# Altium schematic sheet nav teensy.SchDoc
size A3; SheetNumber: 1; SheetTotal: 1
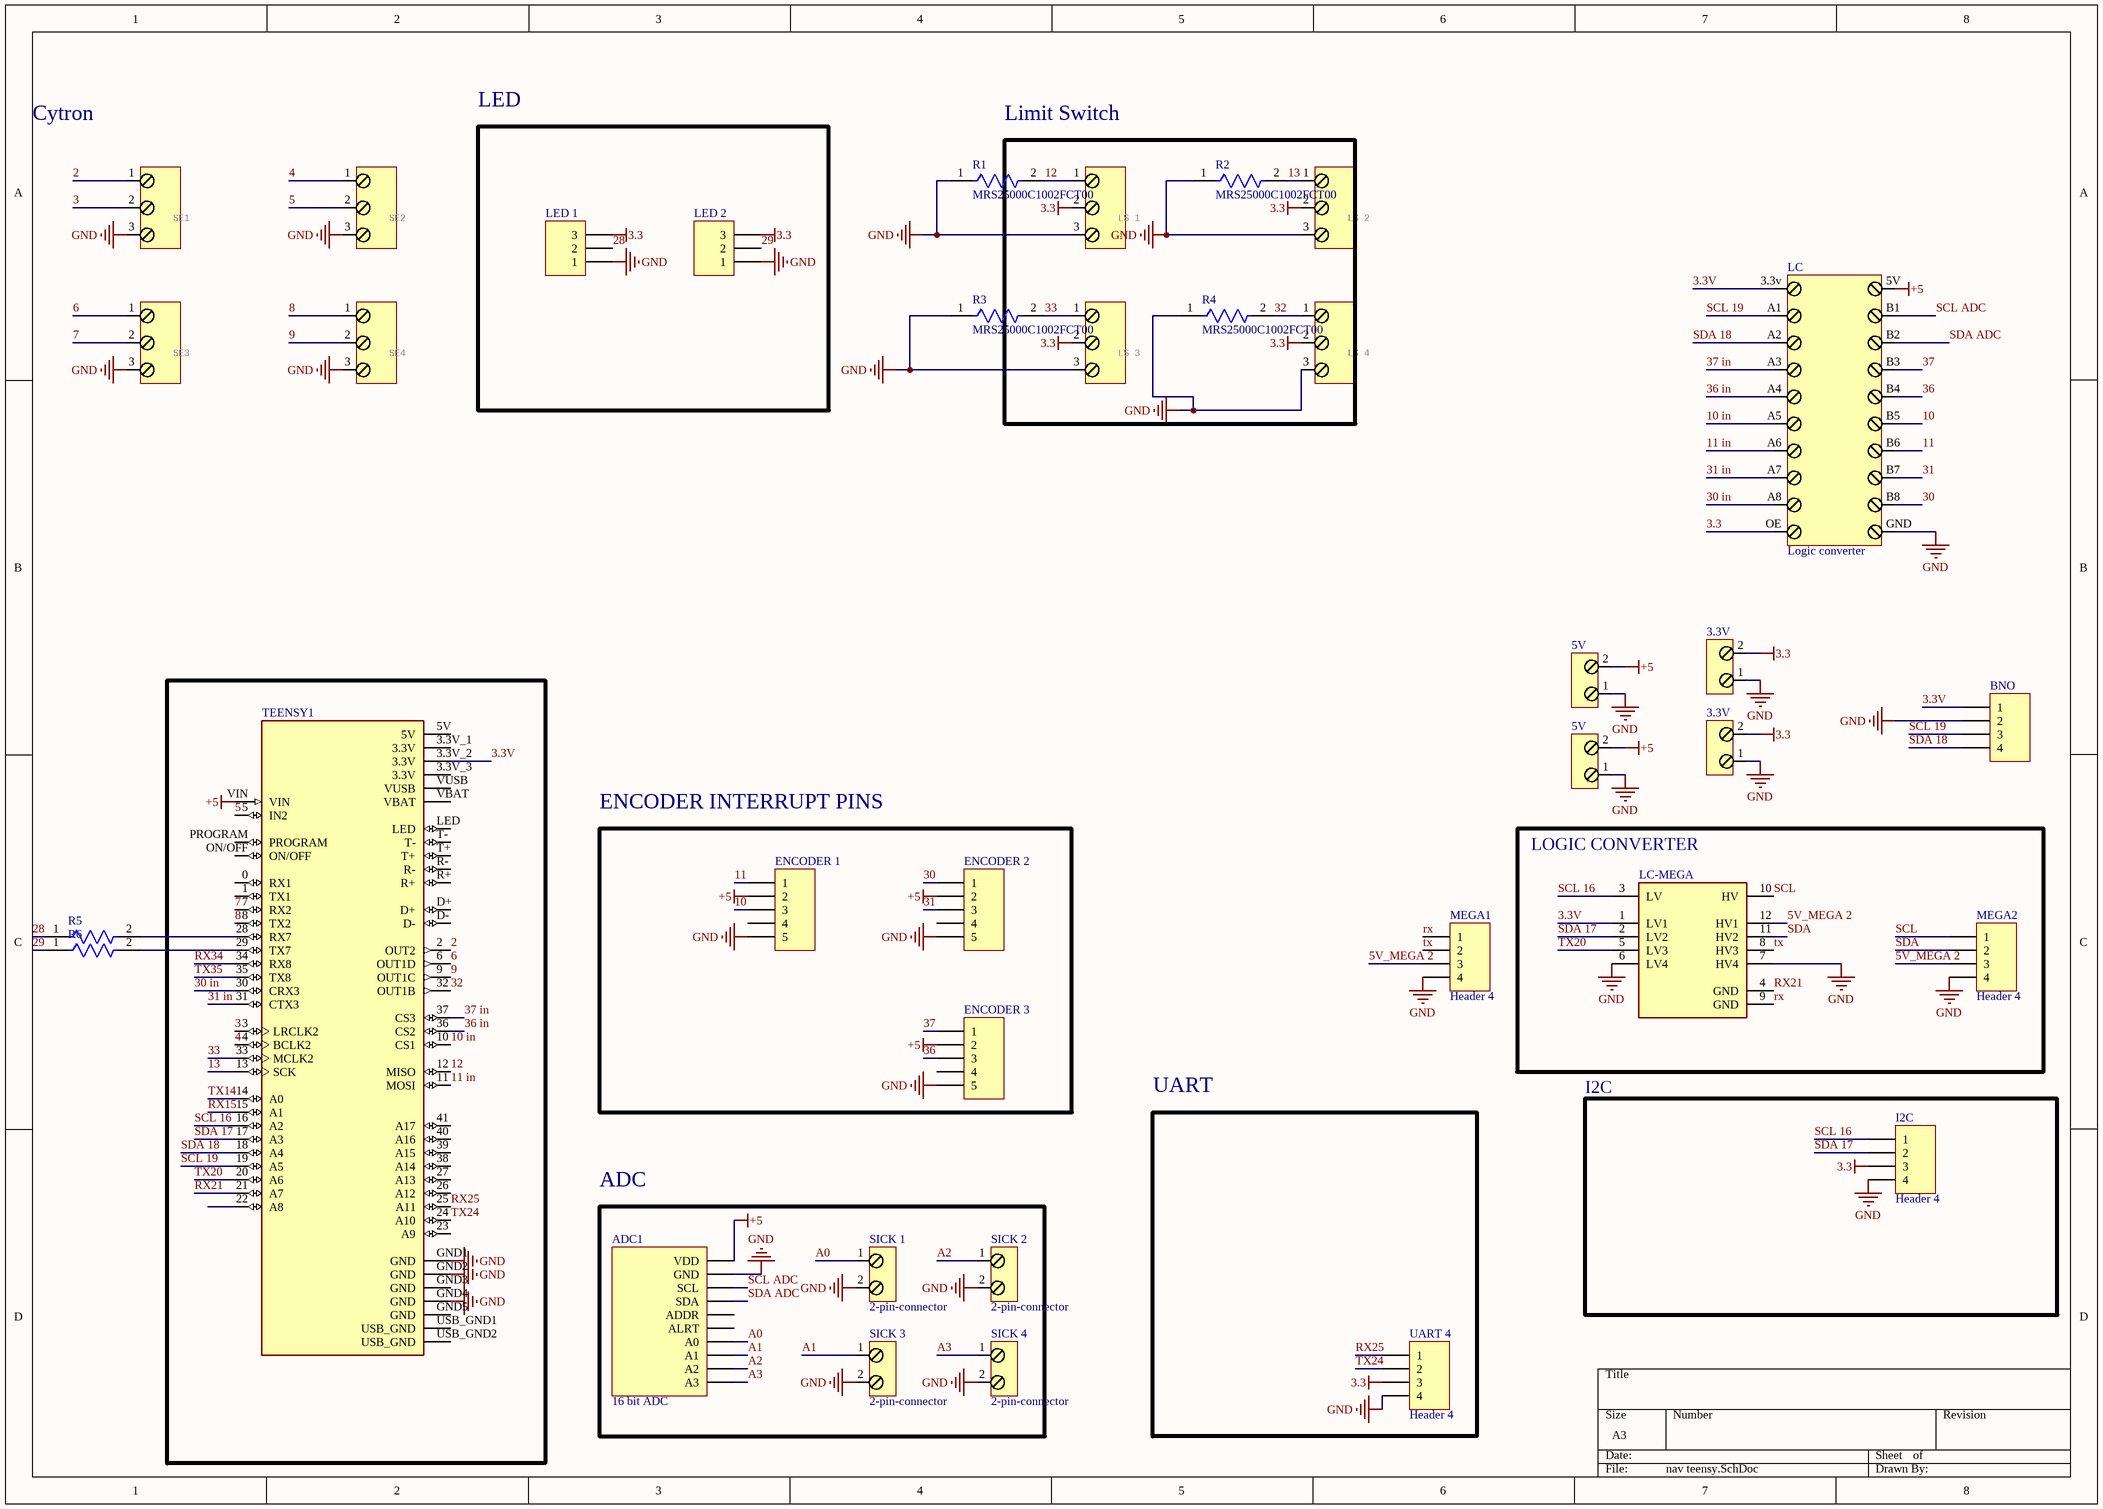
[diagram p0: nav teensy.SchDoc]

## Parts
(Parts that share a designator on the sheet are numbered #1, #2 ... from top to bottom, then left to right.)
3.3V#1  2-pin-connector  [HDR1X2]  (value not drawn)
3.3V#2  2-pin-connector  [HDR1X2]  (value not drawn)
5V#1  2-pin-connector  [HDR1X2]  (value not drawn)
5V#2  2-pin-connector  [HDR1X2]  (value not drawn)
ADC1  16 bit ADC  [16 bit ADC]
BNO  Header 4  [HDR1X4]  (value not drawn)
ENCODER_1  Header 5  [HDR1X5]  (value not drawn)
ENCODER_2  Header 5  [HDR1X5]  (value not drawn)
ENCODER_3  Header 5  [HDR1X5]  (value not drawn)
I2C  Header 4  [HDR1X4]
LC  Logic converter  [LOGIC_CONVERTER_5V-3-3V]
LC-MEGA  BOB-12009  [FP-BOB-12009-MFG]  (value not drawn)
LED_1  Header 3  [HDR1X3]  (value not drawn)
LED_2  Header 3  [HDR1X3]  (value not drawn)
LS_1  PHOENIX CONNECTOR  [HDR1X3]  (value not drawn)
LS_2  PHOENIX CONNECTOR  [HDR1X3]  (value not drawn)
LS_3  PHOENIX CONNECTOR  [HDR1X3]  (value not drawn)
LS_4  PHOENIX CONNECTOR  [HDR1X3]  (value not drawn)
MEGA1  Header 4  [HDR1X4]
MEGA2  Header 4  [HDR1X4]
R1  MRS25000C1002FCT00  [FP-MRS25-MFG]
R2  MRS25000C1002FCT00  [FP-MRS25-MFG]
R3  MRS25000C1002FCT00  [FP-MRS25-MFG]
R4  MRS25000C1002FCT00  [FP-MRS25-MFG]
R5  MRS25000C1002FCT00  [FP-MRS25-MFG]  (value not drawn)
R6  MRS25000C1002FCT00  [FP-MRS25-MFG]  (value not drawn)
SE1  PHOENIX CONNECTOR  [HDR1X3]  (value not drawn)
SE2  PHOENIX CONNECTOR  [HDR1X3]  (value not drawn)
SE3  PHOENIX CONNECTOR  [HDR1X3]  (value not drawn)
SE4  PHOENIX CONNECTOR  [HDR1X3]  (value not drawn)
SICK_1  2-pin-connector  [HDR1X2]
SICK_2  2-pin-connector  [HDR1X2]
SICK_3  2-pin-connector  [HDR1X2]
SICK_4  2-pin-connector  [HDR1X2]
TEENSY1  DEV-16771  [MODULE_DEV-16771]  (value not drawn)
UART_4  Header 4  [HDR1X4]

## Blocks framed on the sheet
LED: LED_1 LED_2
Limit Switch: LS_1-LS_4 R2 R4
ENCODER INTERRUPT PINS: ENCODER_1-ENCODER_3
LOGIC CONVERTER: LC-MEGA MEGA2
I2C: I2C
UART: UART_4
ADC: ADC1 SICK_1-SICK_4

## Nets
3.3: 3.3V#1.2 3.3V#2.2 I2C.3 LC.OE LED_1.3 LED_2.3 LS_1.2 LS_2.2 LS_3.2 LS_4.2 UART_4.3
+5: 5V#1.2 5V#2.2 ADC1.VDD ENCODER_1.2 ENCODER_2.2 ENCODER_3.2 LC.5V TEENSY1.VIN
GND: 3.3V#1.1 3.3V#2.1 5V#1.1 5V#2.1 ADC1.GND BNO.2 ENCODER_1.5 ENCODER_2.5 ENCODER_3.5 I2C.4 LC.GND LC-MEGA.6(LV4) LC-MEGA.7(HV4) LED_1.1 LED_2.1 LS_1.3 LS_2.3 LS_3.3 LS_4.3 MEGA1.4 MEGA2.4 R1.1 R2.1 R3.1 R4.1 SE1.3 SE2.3 SE3.3 SE4.3 SICK_1.2 SICK_2.2 SICK_3.2 SICK_4.2 TEENSY1.GND1(GND) TEENSY1.GND2(GND) TEENSY1.GND4(GND) UART_4.4
2: SE1.1 TEENSY1.2(OUT2)
3: SE1.2 TEENSY1.3(LRCLK2)
3.3V: BNO.1 LC.3.3v LC-MEGA.1(LV1) TEENSY1.3.3V_2(3.3V)
4: SE2.1 TEENSY1.4(BCLK2)
5: SE2.2 TEENSY1.5(IN2)
5V_MEGA 2: LC-MEGA.12(HV1) MEGA1.3 MEGA2.3
6: SE3.1 TEENSY1.6(OUT1D)
7: SE3.2 TEENSY1.7(RX2)
8: SE4.1 TEENSY1.8(TX2)
9: SE4.2 TEENSY1.9(OUT1C)
10: ENCODER_1.3 LC.B5
10 in: LC.A5 TEENSY1.10(CS1)
11: ENCODER_1.1 LC.B6
11 in: LC.A6 TEENSY1.11(MOSI)
12: LS_1.1 R1.2 TEENSY1.12(MISO)
13: LS_2.1 R2.2 TEENSY1.13(SCK)
28: LED_1.2 R5.1
29: LED_2.2 R6.1
30: ENCODER_2.1 LC.B8
30 in: LC.A8 TEENSY1.30(CRX3)
31: ENCODER_2.3 LC.B7
31 in: LC.A7 TEENSY1.31(CTX3)
32: LS_4.1 R4.2 TEENSY1.32(OUT1B)
33: LS_3.1 R3.2 TEENSY1.33(MCLK2)
36: ENCODER_3.3 LC.B4
36 in: LC.A4 TEENSY1.36(CS2)
37: ENCODER_3.1 LC.B3
37 in: LC.A3 TEENSY1.37(CS3)
A0: ADC1.A0 SICK_1.1
A1: ADC1.A1 SICK_3.1
A2: ADC1.A2 SICK_2.1
A3: ADC1.A3 SICK_4.1
rx: LC-MEGA.9(GND) MEGA1.1
RX15: TEENSY1.15(A1)
RX21: LC-MEGA.4(GND) TEENSY1.21(A7)
RX25: TEENSY1.25(A11) UART_4.1
RX34: TEENSY1.34(RX8)
SCL: LC-MEGA.10(HV) MEGA2.1
SCL 16: I2C.1 LC-MEGA.3(LV) TEENSY1.16(A2)
SCL 19: BNO.3 LC.A1 TEENSY1.19(A5)
SCL ADC: ADC1.SCL LC.B1
SDA: LC-MEGA.11(HV2) MEGA2.2
SDA 17: I2C.2 LC-MEGA.2(LV2) TEENSY1.17(A3)
SDA 18: BNO.4 LC.A2 TEENSY1.18(A4)
SDA ADC: ADC1.SDA LC.B2
tx: LC-MEGA.8(HV3) MEGA1.2
TX14: TEENSY1.14(A0)
TX20: LC-MEGA.5(LV3) TEENSY1.20(A6)
TX24: TEENSY1.24(A10) UART_4.2
TX35: TEENSY1.35(TX8)
NetR5_2: R5.2 TEENSY1.28(RX7)
NetR6_2: R6.2 TEENSY1.29(TX7)

Not connected (* = marked no-connect by the designer): ADC1 ADDR ALRT; ENCODER_1 4; ENCODER_2 4; ENCODER_3 4; TEENSY1 0(RX1) 1(TX1) 3.3V_1(3.3V) 3.3V_3(3.3V) 5V 22(A8) 23(A9) 26(A12) 27(A13) 38(A14) 39(A15) 40(A16) 41(A17) D+ D- GND3(GND) GND5(GND) LED ON/OFF PROGRAM R+ R- T+ T- USB_GND1(USB_GND) USB_GND2(USB_GND) VBAT VUSB

## Notes on the sheet
- Cytron

## Library data of the parts
ADC1 = CMP-010-000000-1: Design Item ID: 16 bit ADC; Source: Team Automatons NEW.SCHLIB
BNO I2C MEGA1 MEGA2 UART_4 = Header 4: Header, 4-Pin; LatestRevisionDate: 17-Jul-2002; LatestRevisionNote: Re-released for DXP Platform.; Publisher: Altium Limited
ENCODER_1-ENCODER_3 = Header 5: Header, 5-Pin; LatestRevisionDate: 17-Jul-2002; LatestRevisionNote: Re-released for DXP Platform.; Publisher: Altium Limited
LC = CMP-006-000001-1: Source: Team Automatons NEW (1).SCHLIB; Design Item ID: Logic converter
LC-MEGA = CMP-157458-000001-1: LOGIC LEVEL CONVERTER - BI-DIREC; Logic Function: Translator
LED_1 LED_2 = Header 3: Header, 3-Pin; LatestRevisionDate: 17-Jul-2002; LatestRevisionNote: Re-released for DXP Platform.; Publisher: Altium Limited
LS_1-LS_4 SE1-SE4 = 3-PIN-CONNECTOR: GateName_3: -3; SymbolName_3: SKBV-1; LibraryName: Team Automatons (1); DeviceSetName: 3-PIN-CONNECTOR; Package: 3-PIN-CONNECTOR; OC_FARNELL: unknown; OC_NEWARK: unknown
R1-R6 = CMP-00030-42632392-1: MRS25000C1002FCT00 Resistor, 10 kOhm, ± 1%, 600 mW, Axial Leaded, Metal Film (Thin Film), Professional; Power Rating: 600mW; Voltage Rating (DC): 350V; Lead Length: 26mm; Resistance: 10kΩ; Temperature Coefficient: 50ppm/°C; Termination: Axial; Number of Terminations: 2; Diameter: 2.5mm; Composition: Metal Film, Thin Film; Number of Pins: 2; Length: 6.5mm; Military Standard: Not; RoHS: Compliant; NexarPartId: 42632392; Width: 2.5mm; Radiation Hardening: No; Voltage Rating: 350V; Max Power Dissipation: 600mW; Min Operating Temperature: -55°C; Lead Free: Lead Free; Max Operating Temperature: 155°C; Tolerance: 1%; Schedule B: 8533210090, 8533210090; Contact Plating: Tin; Mount: Through Hole; REACH SVHC: Unknown; Case/Package: Conformal
TEENSY1 = CMP-010-000002-1: RT1062 Teensy 4.1 series ARMÂ® CortexÂ®-M7 MPU Embedded Evaluation Board; MF: SparkFun Electronics; Component Type: Standard; Check_prices: https://www.snapeda.com/parts/DEV-16771/SparkFun+Electronics/view-part/?ref=eda; Pin Count: 65; Purchase-URL: https://pricing.snapeda.com/search/part/DEV-16771/?ref=eda; Price: None; Availability: In Stock; Design Item ID: DEV-16771; SnapEDA_Link: https://www.snapeda.com/parts/DEV-16771/SparkFun+Electronics/view-part/?ref=snap; Source: DEV-16771.SchLib; Value: *; Package: None; MP: DEV-16771